# EAGLE design Esquema (EAGLE 9.6.2)
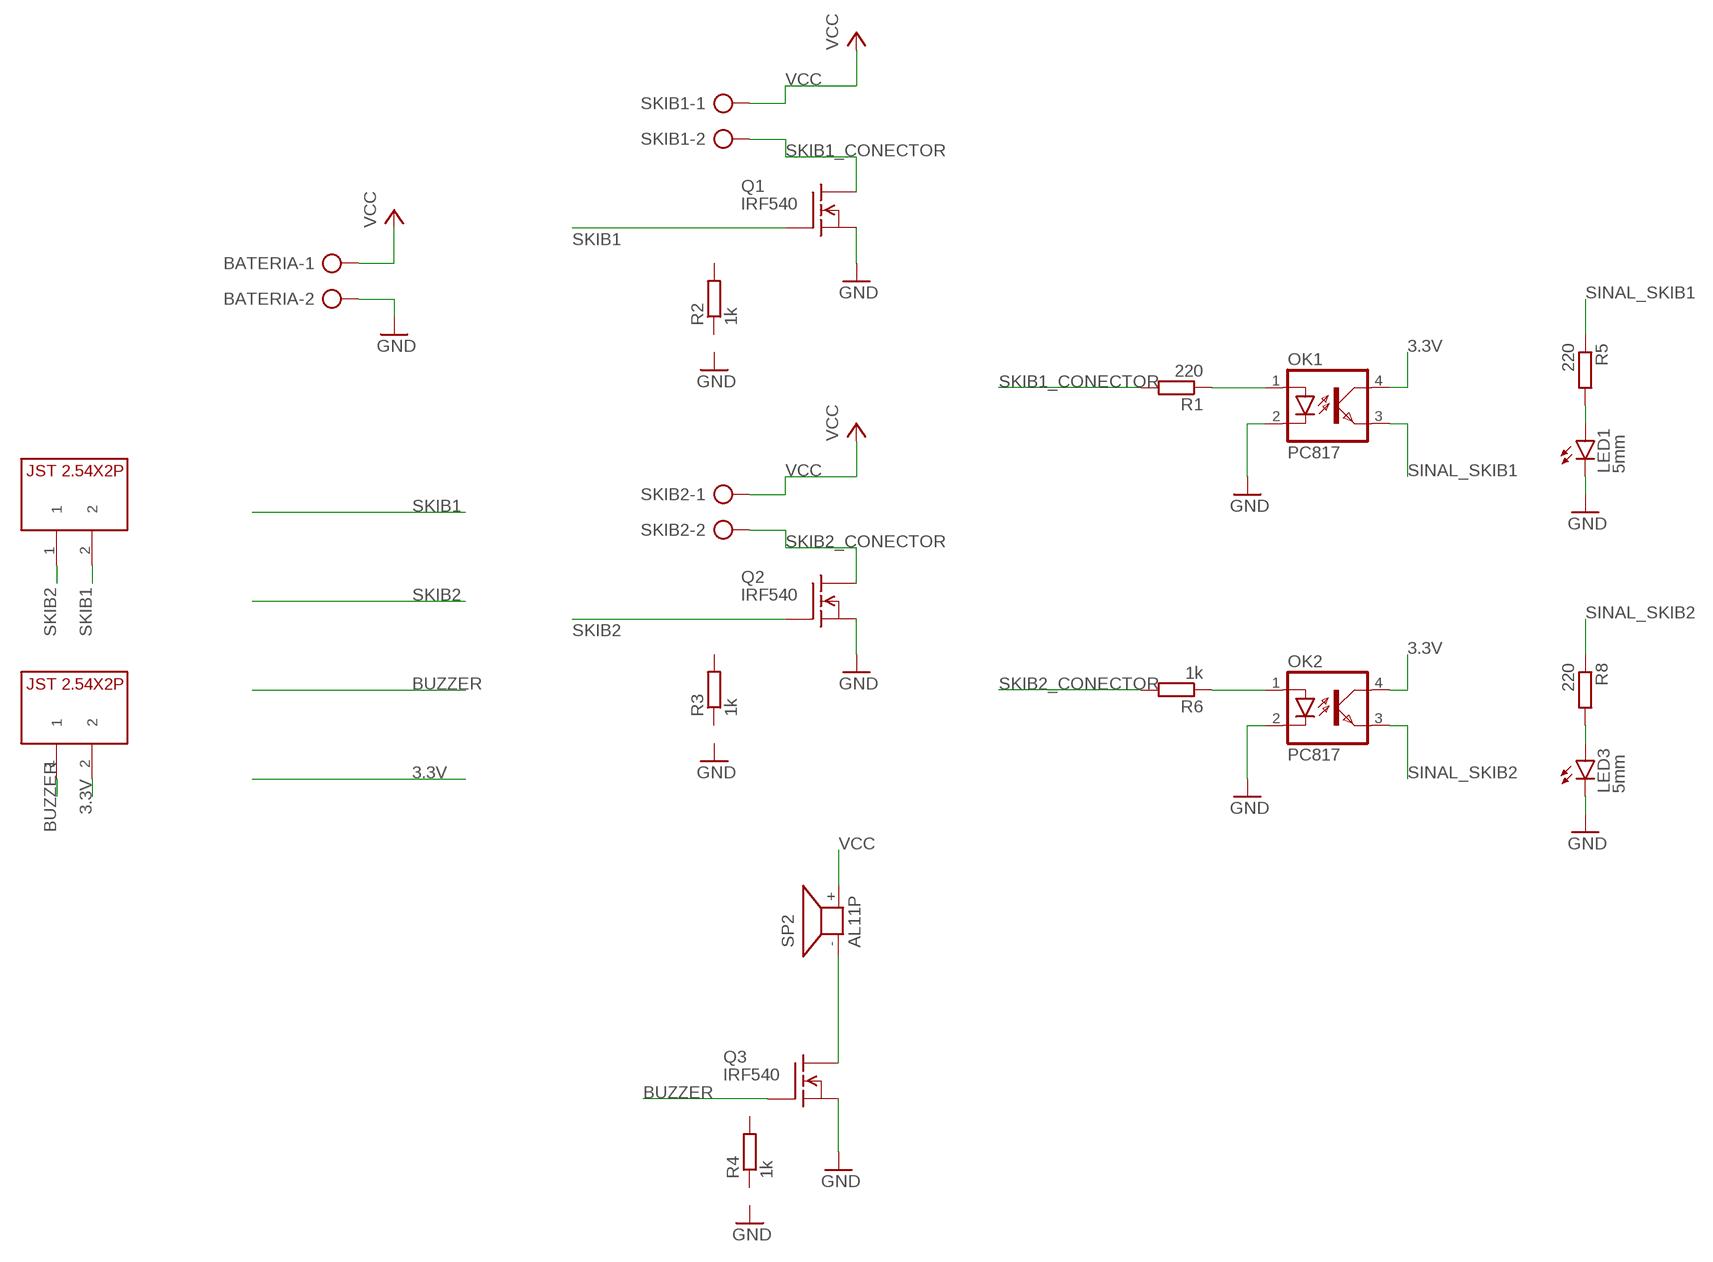
[diagram p0: schematic, sheet 1]

## Parts
BATERIA  AK500/2-H  [AK500/2-H]
LED1  5mm  LED5MM  [LED5MM]
LED3  5mm  LED5MM  [LED5MM]
OK1  PC817  [DIL04]
OK2  PC817  [DIL04]
Q1  IRF540  [TO220]
Q2  IRF540  [TO220]
Q3  IRF540  [TO220]
R1  220  R-EU_0207/10  [0207/10]
R2  1k  R-EU_0207/10  [0207/10]
R3  1k  R-EU_0207/10  [0207/10]
R4  1k  R-EU_0207/10  [0207/10]
R5  220  R-EU_0207/10  [0207/10]
R6  1k  R-EU_0207/10  [0207/10]
R8  220  R-EU_0207/10  [0207/10]
SKIB1  AK500/2-H  [AK500/2-H]
SKIB2  AK500/2-H  [AK500/2-H]
SP2  AL11P  [AL11P]
U$1  JST2.54X2P  [JST2.54X2P_FOOTPRINT]
U$2  JST2.54X2P  [JST2.54X2P_FOOTPRINT]

## Nets
3.3V: OK1.4(COL) OK2.4(COL) U$1.2
BUZZER: Q3.1(G) U$1.1
GND: BATERIA.2 LED1.K(C) LED3.K(C) OK1.2(C) OK2.2(C) Q1.3(S) Q2.3(S) Q3.3(S)
N$2: Q3.2(D) SP2.-
N$3: LED3.A R8.2
N$4: OK1.1(A) R1.1
N$5: OK2.1(A) R6.1
N$6: LED1.A R5.2
SINAL_SKIB1: OK1.3(EMIT) R5.1
SINAL_SKIB2: OK2.3(EMIT) R8.1
SKIB1: Q1.1(G) U$2.2
SKIB1_CONECTOR: Q1.2(D) R1.2 SKIB1.2
SKIB2: Q2.1(G) U$2.1
SKIB2_CONECTOR: Q2.2(D) R6.2 SKIB2.2
VCC: BATERIA.1 SKIB1.1 SKIB2.1 SP2.+
Unconnected: R2.1 R2.2 R3.1 R3.2 R4.1 R4.2

## Library data of the parts
BATERIA SKIB1 SKIB2 = con-ptr500:AK500/2-H: CONNECTOR Aug. 2004 / PTR Meßtechnik: Die Bezeichnung der Serie AK505 wurde geändert. Es handelt sich hierbei um AK500 in horizontaler Ausführung.; OC_FARNELL: unknown; OC_NEWARK: unknown
LED1 LED3 = led:LED: LED OSRAM: - CHIPLED LG R971, LG N971, LY N971, LG Q971, LY Q971, LO R971, LY R971 LH N974, LH R974 LS Q976, LO Q976, LY Q976 LO Q996 - Hyper CHIPLED LW Q18S LB Q993, LB Q99A, LB R99A - SideLED LS A670, LO A670, LY A670, LG A670, LP A670 LB A673, LV A673, LT A673, LW A673 LH A674 LY A675 LS A676, LA A676, LO A676, LY A676, LW A676 LS A679, LY A679, LG A679 - Hyper Micro SIDELED® LS Y876, LA Y876, LO Y876, LY Y876 LT Y87S - SmartLED LW L88C, LW L88S LB L89C, LB L89S, LG L890 LS L89K, LO L89K, LY L89K LS L896, LA L896, LO L896, LY L896 - TOPLED LS T670, LO T670, LY T670, LG T670, LP T670 LSG T670, LSP T670, LSY T670, LOP T670, LYG T670 LG T671, LOG T671, LSG T671 LB T673, LV T673, LT T673, LW T673 LH T674 LS T676, LA T676, LO T676, LY T676, LB T676, LH T676, LSB T676, LW T676 LB T67C, LV T67C, LT T67C, LS T67K, LO T67K, LY T67K, LW E67C LS E67B, LA E67B, LO E67B, LY E67B, LB E67C, LV E67C, LT E67C LW T67C LS T679, LY T679, LG T679 LS T770, LO T770, LY T770, LG T770, LP T770 LB T773, LV T773, LT T773, LW T773 LH T774 LS E675, LA E675, LY E675, LS T675 LS T776, LA T776, LO T776, LY T776, LB T776 LHGB T686 LT T68C, LB T68C - Hyper Mini TOPLED® LB M676 - Mini TOPLED Santana® LG M470 LS M47K, LO M47K, LY M47K Source: http://www.osram.convergy.de LUXEON: - LUMILED® LXK2-PW12-R00, LXK2-PW12-S00, LXK2-PW14-U00, LXK2-PW14-V00 LXK2-PM12-R00, LXK2-PM12-S00, LXK2-PM14-U00 LXK2-PE12-Q00, LXK2-PE12-R00, LXK2-PE12-S00, LXK2-PE14-T00, LXK2-PE14-U00 LXK2-PB12-K00, LXK2-PB12-L00, LXK2-PB12-M00, LXK2-PB14-N00, LXK2-PB14-P00, LXK2-PB14-Q00 LXK2-PR12-L00, LXK2-PR12-M00, LXK2-PR14-Q00, LXK2-PR14-R00 LXK2-PD12-Q00, LXK2-PD12-R00, LXK2-PD12-S00 LXK2-PH12-R00, LXK2-PH12-S00 LXK2-PL12-P00, LXK2-PL12-Q00, LXK2-PL12-R00 Source: www.luxeon.com KINGBRIGHT: KA-3528ASYC Source: www.kingbright.com
OK1 OK2 = optocoupler:PC817: SHARP OPTO COUPLER; MPN: PC817X4J000F; OC_FARNELL: 9707727; OC_NEWARK: 97K7059
Q1-Q3 = transistor-fet:IRF540: N-Channel Enhancement MOSFET (HEXFET); 100V; 28A; 0,077Ohm
R1-R6 R8 = rcl:R-EU_: RESISTOR, European symbol; SPICEPREFIX: R
SP2 = buzzer:AL11P: SPEAKER Source: Buerklin; OC_FARNELL: unknown; OC_NEWARK: unknown
U$1 U$2 = CRD:JST2.54X2P: Conector JST 2 pinos (2.54mm de distância entre pinos)

## Board
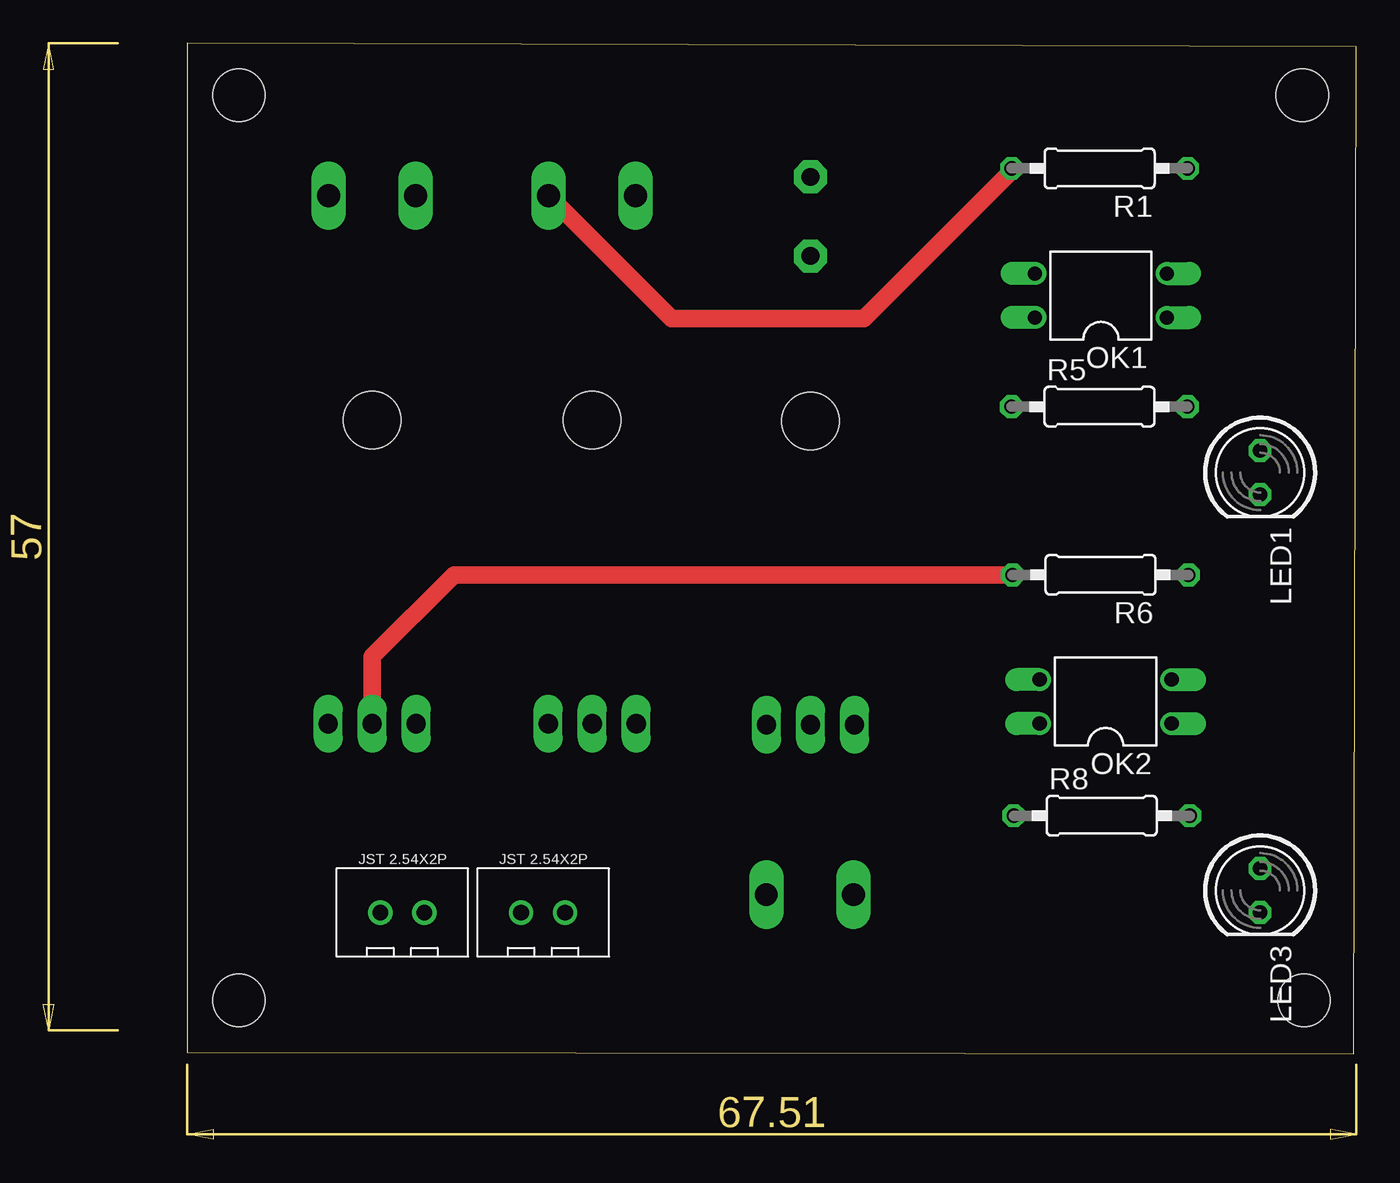
[diagram p1: board, top side]
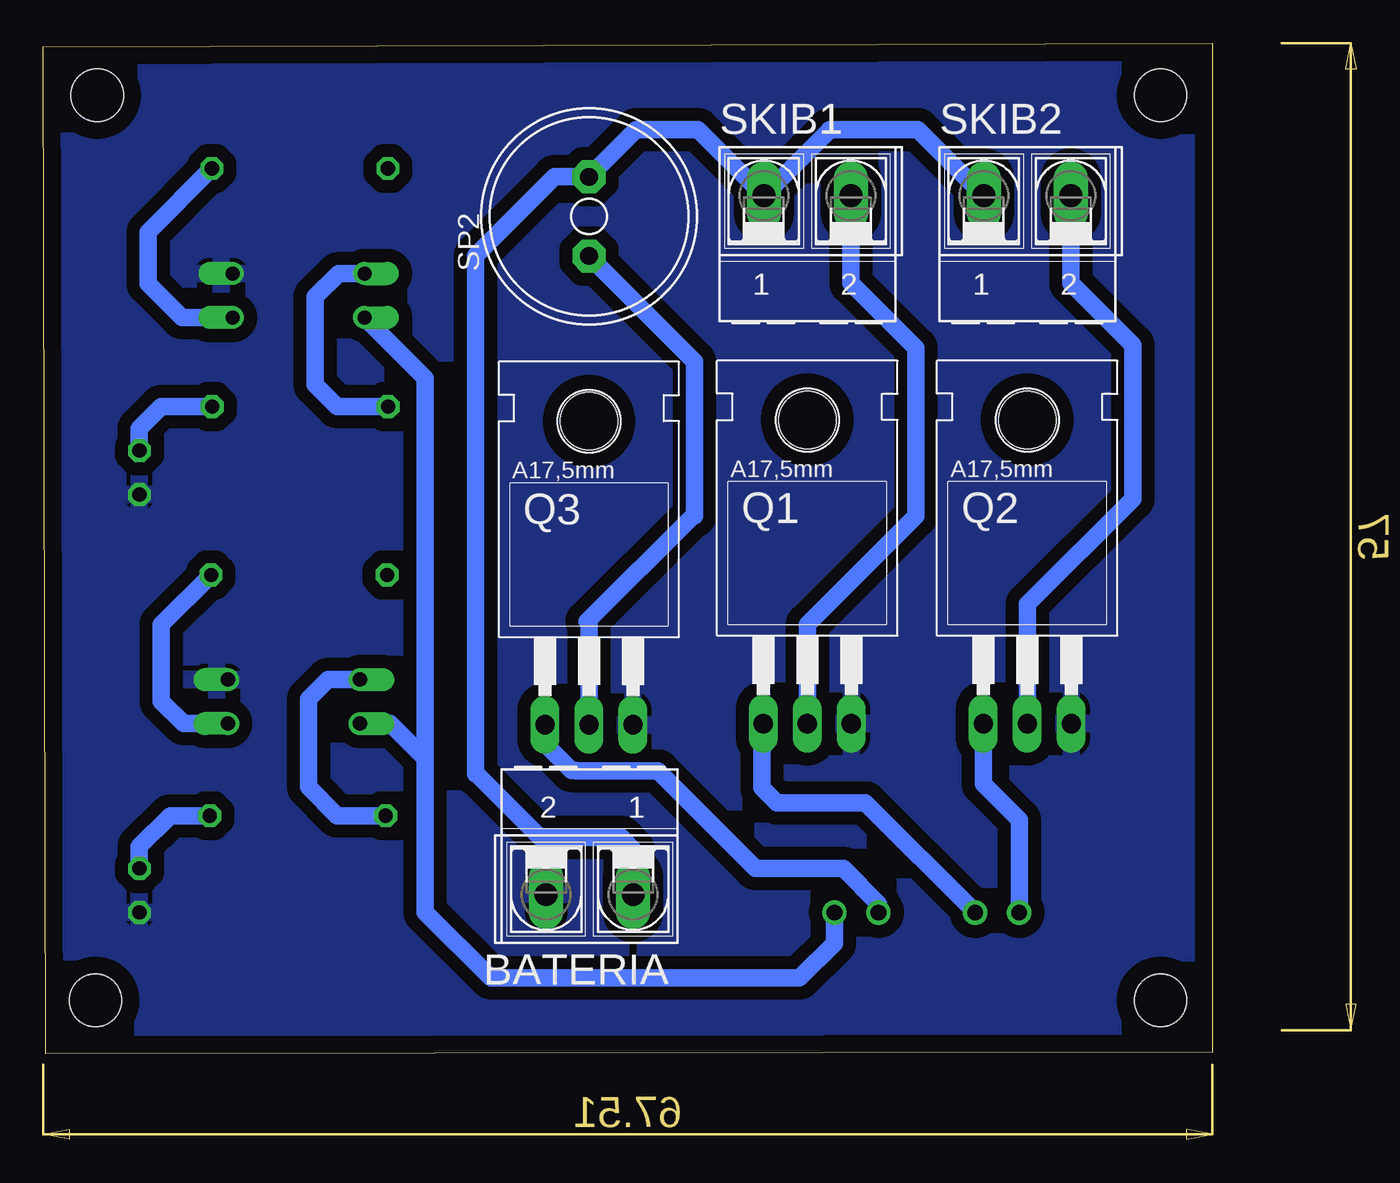
[diagram p2: board, bottom side, seen from below]

Size 67.5 x 58.34 mm. Coordinates in mm from the lower left corner, seen from the top.
Outline: 0,0.07 67.37,0 67.5,58.14 0,58.34 0,0.07
Copper layers (1*16): Top 0.035mm / dielectric 1.5mm / Bottom 0.035mm
Design rules "default *": minimum track width 1mm, minimum drill 0.35mm, track to track 30mil, track to pad 0.5mm, pad to pad 6mil, via to via 6mil, smd to smd 6mil, copper to edge 40mil, drill to drill 6mil, minimum pad ring 10mil, minimum via ring 8mil, stop-mask expansion 4mil, vias tented up to drill 0mil, thermal gap 10mil
Holes 3 mm at 64.4,55.34 3,55.34 64.5,3.07 3,3.07

### Footprints (pad centres in the part's own frame; a part is rotated, then mirrored left to right if it is on the bottom)
AK500/2-H = drill 1.321 long: 1 -2.515,0; 2 2.515,0
LED5MM = drill 0.813 octagon: A -1.27,0; K 1.27,0
DIL04 = drill 0.813 offset: 1 -1.27,-3.81; 2 1.27,-3.81; 3 1.27,3.81; 4 -1.27,3.81
TO220 = drill 1.118 long: 1 -2.54,-6.35; 2 0,-6.35; 3 2.54,-6.35 | hole 3.302: 0,11.176
0207/10 = drill 0.813 octagon: 1 -5.08,0; 2 5.08,0
AL11P = drill 1.016 pad 1.905 octagon: + 2.286,0; - -2.286,0
JST2.54X2P_FOOTPRINT = drill 0.9: 1 -1.27,0; 2 1.27,0

### Placement (x,y rotation side)
BATERIA  35.96,9.18 180 bottom
LED1  61.96,33.55 270 top
LED3  61.96,9.42 270 top
OK1  52.77,43.78 90 top
OK2  53.04,20.33 90 top
Q1  23.39,25.41 0 bottom
Q2  10.69,25.41 0 bottom
Q3  36,25.34 0 bottom
R1  52.69,51.12 180 top
R2  83.7,12.8 0 top  (outside the outline)
R3  83.7,8.2 0 top  (outside the outline)
R4  83.7,3.6 0 top  (outside the outline)
R5  52.69,37.36 0 top
R6  52.75,27.65 180 top
R8  52.82,13.74 0 top
SKIB1  23.39,49.54 0 bottom
SKIB2  10.69,49.54 0 bottom
SP2  36,48.34 90 bottom
U$1  20.56,8.15 0 top
U$2  12.43,8.15 0 top

### Tracks (layer width: path | path; a pad name or v marks a point on that pad's centre or on a via)
3.3V
  Bottom 1: OK1.4 45.45,39 45.45,17.04 | 45.45,17.04 45.45,8.15 41.66,4.37 23.84,4.37 21.83,6.38 U$1.2 | 45.45,17.04 47.47,19.06 OK2.4
BUZZER
  Bottom 1: Q3.1 38.54,17.88 37,16.34 36.79,16.34 36.76,16.32 32.02,16.32 26.4,10.69 21.32,10.69 19.29,8.66 U$1.1
GND
  pour Bottom: 1,57.34 1,1.07 66.7,1.07 66.7,57.34
N$2
  Bottom 1: SP2.- 29.9,39.96 29.9,31.04 30,31.04 36.1,24.94 36,24.84 Q3.2
N$3
  Bottom 1: R8.2 60.18,13.74 61.96,11.96 LED3.A
N$4
  Bottom 1: OK1.1 59.49,42.51 61.45,44.47 61.45,46.76 61.45,47.44 R1.1
N$5
  Bottom 1: OK2.1 59.41,19.06 60.69,20.34 60.69,23.39 60.69,24.79 R6.1
N$6
  Bottom 1: R5.2 60.69,37.36 61.96,36.09 LED1.A
SINAL_SKIB1
  Bottom 1: OK1.3 50.46,45.05 51.8,43.71 51.8,38.63 50.53,37.36 R5.1
SINAL_SKIB2
  Bottom 1: OK2.3 51.05,21.6 52.18,20.47 52.18,15.39 50.53,13.74 R8.1
SKIB1
  Bottom 1: Q1.1 26,18.99 26,15.34 25.14,14.49 20.04,14.49 U$2.2
SKIB1_CONECTOR
  Top 1: SKIB1.2 27.98,42.44 39.1,42.44 47.61,50.96 R1.2
  Bottom 1: Q1.2 23.39,24.79 17.13,31.05 17.13,40.74 20.88,44.49 SKIB1.2
SKIB2
  Bottom 1: Q2.1 13.23,15.57 11.16,13.5 U$2.1
SKIB2_CONECTOR
  Top 1: Q2.2 10.69,22.92 15.42,27.65 R6.2
  Bottom 1: Q2.2 10.69,25.95 4.61,32.03 4.61,40.92 8.18,44.49 SKIB2.2
VCC
  Bottom 1: SKIB2.1 17.02,53.35 22.12,53.35 22.12,53.33 SKIB1.1 29.7,53.34 33.29,53.34 SP2.+ 38,50.63 42.54,46.09 42.54,16.14 42.5,16.14 38.83,12.47 34.13,12.47 33.45,11.79 BATERIA.1